# EAGLE design MOD-W_V03 (EAGLE 9.6.2)

## Sheet 1 of 2
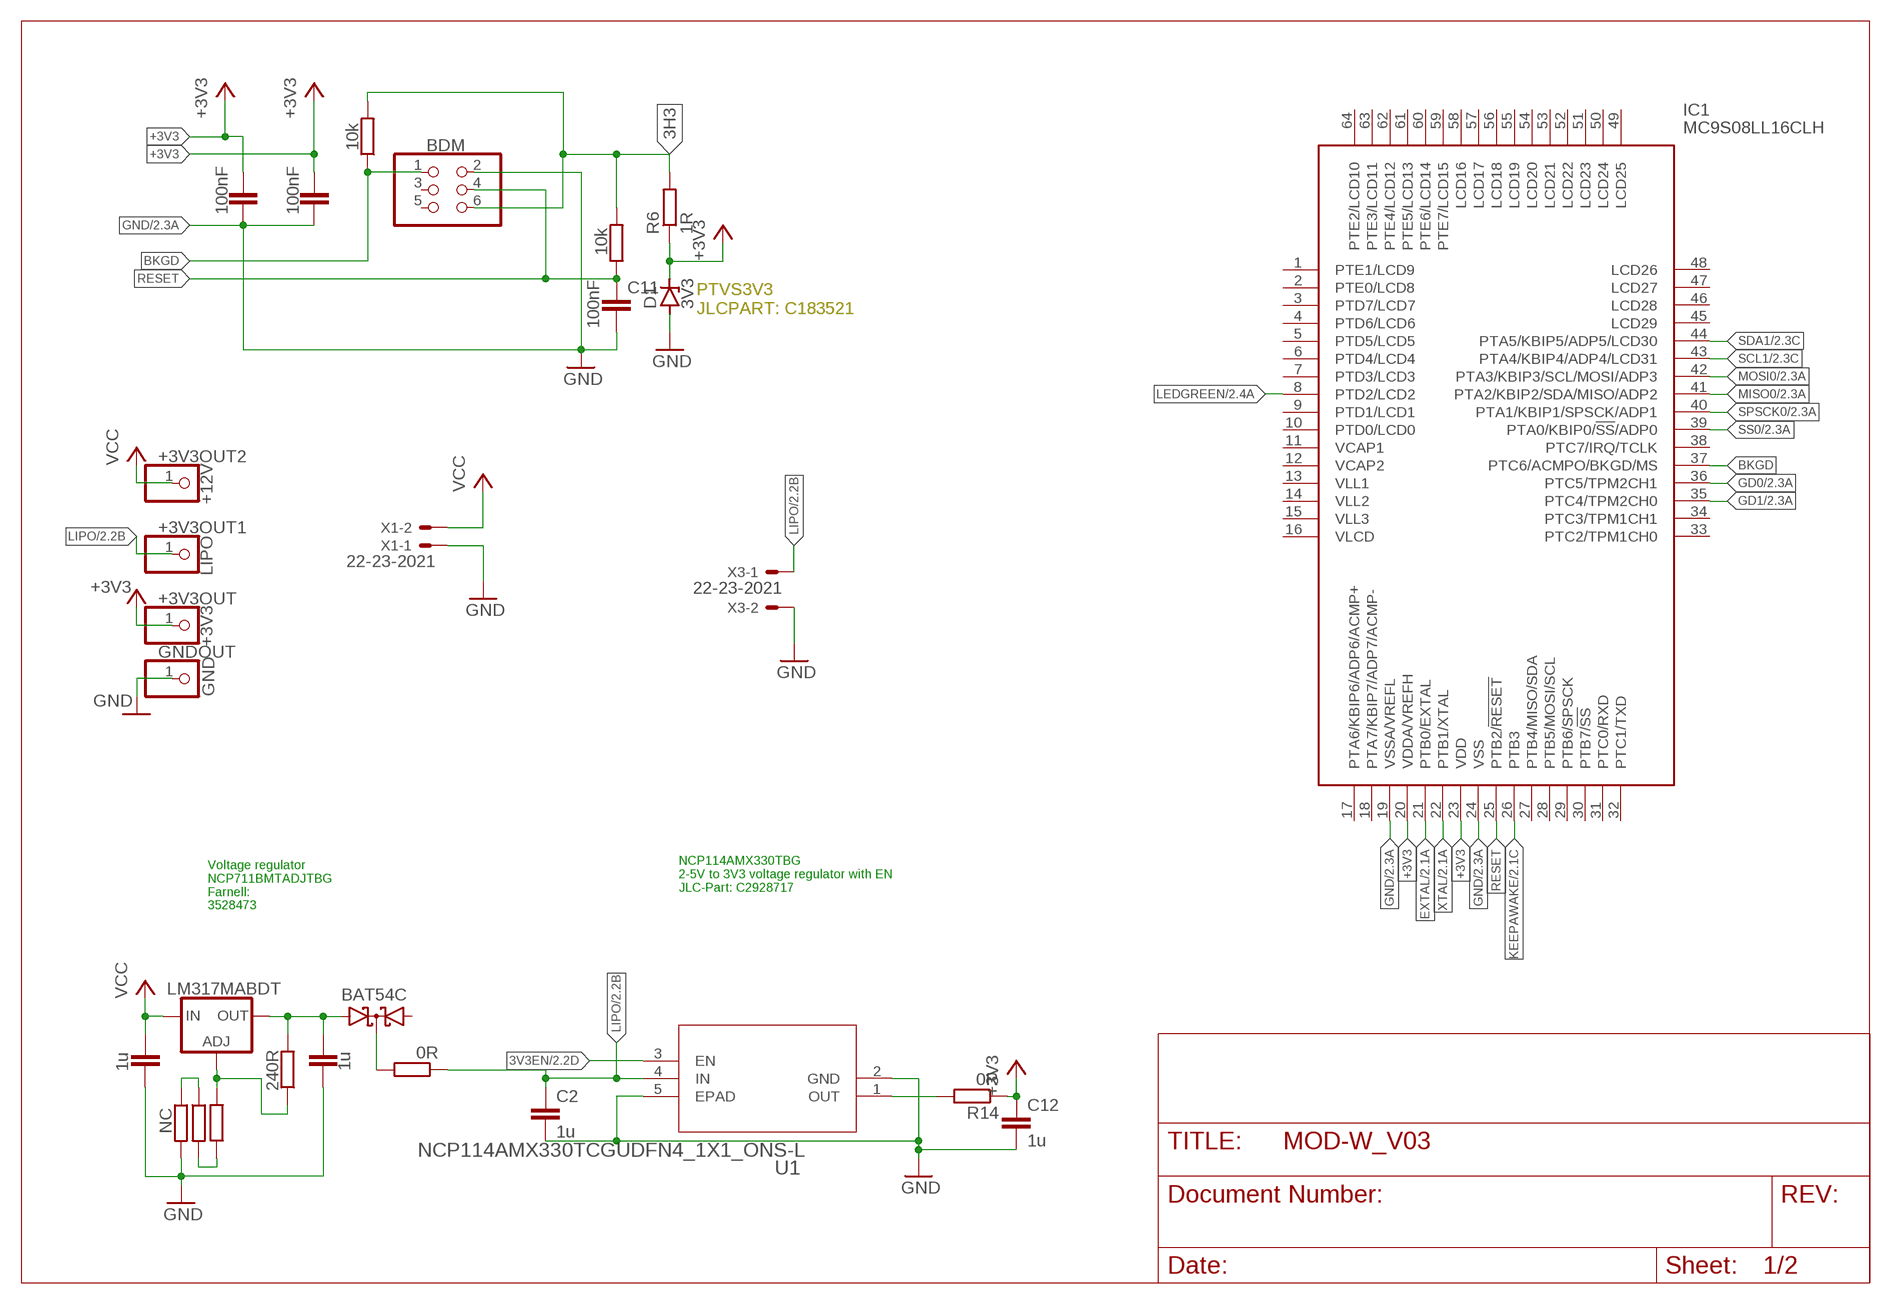
[diagram p0: schematic, sheet 1]

### Parts
+3V3OUT  +3V3  PINHD-1X1  [1X01]
+3V3OUT1  LIPO  PINHD-1X1  [1X01]
+3V3OUT2  +12V  PINHD-1X1  [1X01]
BDM  PINHD-2X3  [2X03]
C1  1u  C-EUC0805  [C0805]
C2  1u  C-EUC0805  [C0805]
C9  100nF  C-EUC0805  [C0805]
C10  100nF  C-EUC0805  [C0805]
C11  100nF  C-EUC0805  [C0805]
C12  1u  C-EUC0805  [C0805]
C13  1u  C-EUC0805  [C0805]
D1  3V3  ZENER-DIODESOD80C  [SOD80C]
D7  BAT54C  [SOT23]
GNDOUT  GND  PINHD-1X1  [1X01]
IC1  MC9S08LL16CLH  [QFP50P1200X1200X160-64N]
IC4  LM317MABDT  [DPACK]
R2  NC  R-EU_R0805  [R0805]
R6  1R  R-EU_R0805  [R0805]
R7  0R  R-EU_R0805  [R0805]
R14  0R  R-EU_R0805  [R0805]
R15  240R  R-EU_R0805  [R0805]
R16  10k  R-EU_R0805  [R0805]
R17  10k  R-EU_R0805  [R0805]
R18  NC  R-EU_R0805  [R0805]
R19  NC  R-EU_R0805  [R0805]
U1  NCP114AMX330TCGUDFN4_1X1_ONS-L  [UDFN4_1X1_ONS-L]
X1  22-23-2021  [22-23-2021]
X3  22-23-2021  [22-23-2021]

### Nets
3H3: BDM.6 R6.2 R16.2 R17.2
3V3EN: U1.3(EN) ; also sheet 2
+3V3: +3V3OUT.1 C9.1 C10.1 C12.1 D1.C IC1.20(VDDA/VREFH) IC1.23(VDD) R6.1 R14.1 ; also sheet 2
BKGD: BDM.1 IC1.37(PTC6/ACMPO/BKGD/MS) R16.1
EXTAL: IC1.21(PTB0/EXTAL) ; also sheet 2
GD0: IC1.36(PTC5/TPM2CH1) ; also sheet 2
GD1: IC1.35(PTC4/TPM2CH0) ; also sheet 2
GND: BDM.2 C1.2 C2.2 C9.2 C10.2 C11.2 C12.2 C13.2 D1.A GNDOUT.1 IC1.19(VSSA/VREFL) IC1.24(VSS) R19.2 U1.2(GND) U1.5(EPAD) X1.1 X3.2 ; also sheet 2
KEEPAWAKE: IC1.26(PTB3) ; also sheet 2
LEDGREEN: IC1.8(PTD2/LCD2) ; also sheet 2
LIPO: +3V3OUT1.1 C2.1 R7.1 U1.4(IN) X3.1 ; also sheet 2
MISO0: IC1.41(PTA2/KBIP2/SDA/MISO/ADP2) ; also sheet 2
MOSI0: IC1.42(PTA3/KBIP3/SCL/MOSI/ADP3) ; also sheet 2
N$5: D7.3(CC) R7.2
N$7: R14.2 U1.1(OUT)
N$8: R2.2 R18.1
N$9: R2.1 R19.1
N$12: C1.1 D7.2(A2) IC4.4(OUT) R15.2
N$14: IC4.1(ADJ) R15.1 R18.2
RESET: BDM.4 C11.1 IC1.25(PTB2/!RESET) R17.1
SCL1: IC1.43(PTA4/KBIP4/ADP4/LCD31) ; also sheet 2
SDA1: IC1.44(PTA5/KBIP5/ADP5/LCD30) ; also sheet 2
SPSCK0: IC1.40(PTA1/KBIP1/SPSCK/ADP1) ; also sheet 2
SS0: IC1.39(PTA0/KBIP0/!SS!/ADP0) ; also sheet 2
VCC: +3V3OUT2.1 C13.1 IC4.3(IN) X1.2
XTAL: IC1.22(PTB1/XTAL) ; also sheet 2
Unconnected: BDM.3 BDM.5 D7.1(A1) IC1.1(PTE1/LCD9) IC1.2(PTE0/LCD8) IC1.3(PTD7/LCD7) IC1.4(PTD6/LCD6) IC1.5(PTD5/LCD5) IC1.6(PTD4/LCD4) IC1.7(PTD3/LCD3) IC1.9(PTD1/LCD1) IC1.10(PTD0/LCD0) IC1.11(VCAP1) IC1.12(VCAP2) IC1.13(VLL1) IC1.14(VLL2) IC1.15(VLL3) IC1.16(VLCD) IC1.17(PTA6/KBIP6/ADP6/ACMP+) IC1.18(PTA7/KBIP7/ADP7/ACMP-) IC1.27(PTB4/MISO/SDA) IC1.28(PTB5/MOSI/SCL) IC1.29(PTB6/SPSCK) IC1.30(PTB7/!SS) IC1.31(PTC0/RXD) IC1.32(PTC1/TXD) IC1.33(PTC2/TPM1CH0) IC1.34(PTC3/TPM1CH1) IC1.38(PTC7/IRQ/TCLK) IC1.45(LCD29) IC1.46(LCD28) IC1.47(LCD27) IC1.48(LCD26) IC1.49(LCD25) IC1.50(LCD24) IC1.51(LCD23) IC1.52(LCD22) IC1.53(LCD21) IC1.54(LCD20) IC1.55(LCD19) IC1.56(LCD18) IC1.57(LCD17) IC1.58(LCD16) IC1.59(PTE7/LCD15) IC1.60(PTE6/LCD14) IC1.61(PTE5/LCD13) IC1.62(PTE4/LCD12) IC1.63(PTE3/LCD11) IC1.64(PTE2/LCD10)

### Notes on the sheet
- PTVS3V3 
  JLCPART: C183521
- NCP114AMX330TBG
  2-5V to 3V3 voltage regulator with EN
  JLC-Part: C2928717
- Voltage regulator
  NCP711BMTADJTBG
  Farnell: 
  3528473

## Sheet 2 of 2
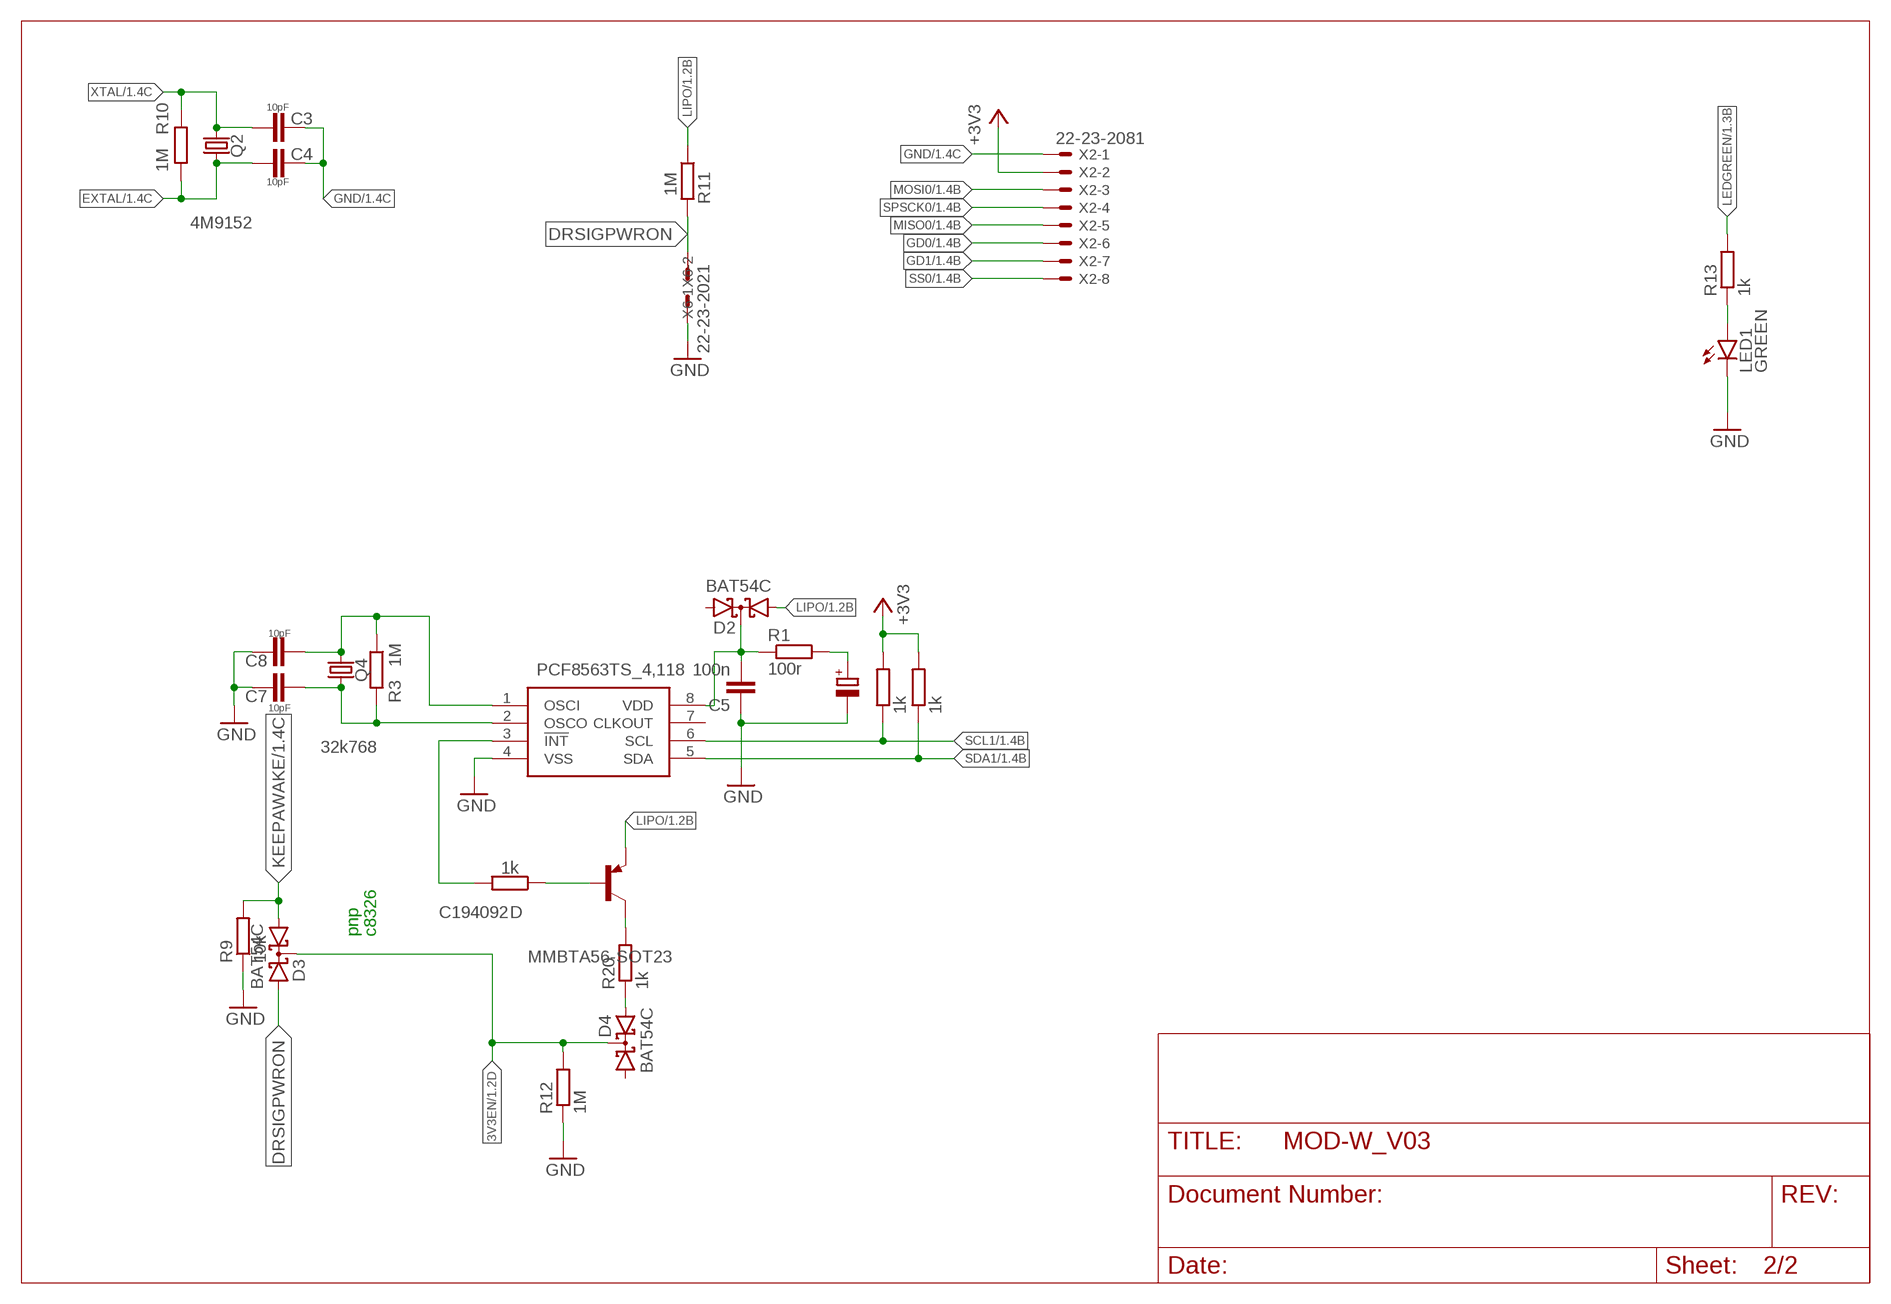
[diagram p1: schematic, sheet 2]

### Parts
C3  10pF  C-EUC0805  [C0805]
C4  10pF  C-EUC0805  [C0805]
C5  100n  C-EUC0805  [C0805]
C6  100u  CPOL-EUE  [PANASONIC_E]
C7  10pF  C-EUC0805  [C0805]
C8  10pF  C-EUC0805  [C0805]
D2  BAT54C  [SOT23]
D3  BAT54C  [SOT23]
D4  BAT54C  [SOT23]
IC3  PCF8563TS_4,118  [SOP65P490X110-8N]
LED1  GREEN  LEDCHIP-LED0805  [CHIP-LED0805]
Q2  4M9152  CRYSTALHC49UP  [HC49UP]
Q3  MMBTA56-SOT23  [SOT23]
Q4  32k768  CRYSTALTC38H  [TC38H]
R1  100r  R-EU_R0805  [R0805]
R3  1M  R-EU_R0805  [R0805]
R4  1k  R-EU_R0805  [R0805]
R5  1k  R-EU_R0805  [R0805]
R8  1k  R-EU_R0805  [R0805]
R9  10k  R-EU_R0805  [R0805]
R10  1M  R-EU_R0805  [R0805]
R11  1M  R-EU_R0805  [R0805]
R12  1M  R-EU_R0805  [R0805]
R13  1k  R-EU_R0805  [R0805]
R20  1k  R-EU_R0805  [R0805]
X2  22-23-2081  [22-23-2081]
X6  22-23-2021  [22-23-2021]

### Nets
3V3EN: D3.3(CC) D4.3(CC) R12.2 ; also sheet 1
+3V3: R4.2 R5.2 X2.2 ; also sheet 1
DRSIGPWRON: D3.2(A2) R11.2 X6.1
EXTAL: C4.1 Q2.1 R10.1 ; also sheet 1
EXTAL1: C8.1 IC3.1(OSCI) Q4.2 R3.1
GD0: X2.6 ; also sheet 1
GD1: X2.7 ; also sheet 1
GND: C3.2 C4.2 C5.1 C6.- C7.2 C8.2 IC3.4(VSS) LED1.C R9.1 R12.1 X2.1 X6.2 ; also sheet 1
KEEPAWAKE: D3.1(A1) R9.2 ; also sheet 1
LEDGREEN: R13.2 ; also sheet 1
LIPO: D2.1(A1) Q3.2(E) R11.1 ; also sheet 1
MISO0: X2.5 ; also sheet 1
MOSI0: X2.3 ; also sheet 1
N$1: C5.2 D2.3(CC) IC3.8(VDD) R1.1
N$2: C6.+ R1.2
N$3: IC3.3(!INT) R8.2
N$4: Q3.1(B) R8.1
N$6: D4.2(A2) R20.1
N$10: LED1.A R13.1
N$11: Q3.3(C) R20.2
SCL1: IC3.6(SCL) R4.1 ; also sheet 1
SDA1: IC3.5(SDA) R5.1 ; also sheet 1
SPSCK0: X2.4 ; also sheet 1
SS0: X2.8 ; also sheet 1
XTAL: C3.1 Q2.2 R10.2 ; also sheet 1
XTAL1: C7.1 IC3.2(OSCO) Q4.1 R3.2
Unconnected: D2.2(A2) D4.1(A1) IC3.7(CLKOUT)

### Notes on the sheet
- C194092 | D
- pnp | c8326

## Library data of the parts
+3V3OUT +3V3OUT1 +3V3OUT2 GNDOUT = pinhead:PINHD-1X1: PIN HEADER
BDM = pinhead:PINHD-2X3: PIN HEADER
C1-C5 C7-C13 = rcl:C-EU: CAPACITOR, European symbol; SPICEPREFIX: C
C6 = rcl:CPOL-EU: POLARIZED CAPACITOR, European symbol; SPICEPREFIX: C
D1 = diode:ZENER-DIODE: Z-Diode
D2-D4 D7 = diode:BAT54C: Schottky Diodes Source: Fairchild .. BAT54.pdf
IC1 = MC9S08LL16CLH:MC9S08LL16CLH: MCU 8-bit S08 CISC 16KB Flash 2.5V/3.3V 64-Pin LQFP Tray Source: Datasheet <http://www.nxp.com/docs/en/data-sheet/MC9S08LL16.pdf>; ARROW_PART_NUMBER: MC9S08LL16CLH; ARROW_PRICE-STOCK: https://www.arrow.com/en/products/mc9s08ll16clh/nxp-semiconductors; DESCRIPTION: MCU 8-bit S08 CISC 16KB Flash 2.5V/3.3V 64-Pin LQFP Tray; HEIGHT: 1.6mm; MANUFACTURER_NAME: NXP; MANUFACTURER_PART_NUMBER: MC9S08LL16CLH; MOUSER_PART_NUMBER: 841-MC9S08LL16CLH; MOUSER_PRICE-STOCK: https://www.mouser.com/Search/Refine.aspx?Keyword=841-MC9S08LL16CLH
IC3 = PCF8563TS_4_118:PCF8563TS_4,118: Real Time Clock ULTRA LOW PWR CLOCK RTC IC Source: Datasheet <http://www.nxp.com/docs/en/data-sheet/PCF8563.pdf>; ARROW_PART_NUMBER: PCF8563TS/4,118; ARROW_PRICE-STOCK: https://www.arrow.com/en/products/pcf8563ts4118/nxp-semiconductors?region=nac; DESCRIPTION: Real Time Clock ULTRA LOW PWR CLOCK RTC IC; HEIGHT: 1.1mm; MANUFACTURER_NAME: NXP; MANUFACTURER_PART_NUMBER: PCF8563TS/4,118; MOUSER_PART_NUMBER: 771-PCF8563TS-T; MOUSER_PRICE-STOCK: https://www.mouser.co.uk/ProductDetail/NXP-Semiconductors/PCF8563TS-4118?qs=LOCUfHb8d9ugg%2FdJSyv6Ig%3D%3D
IC4 = v-reg:LM317?*: 500 mA Adjustable Output Positive Voltage Regulator Source: http://www.onsemi.co.jp .. LM317M-D.PDF
LED1 = led:LED: LED OSRAM: - CHIPLED LG R971, LG N971, LY N971, LG Q971, LY Q971, LO R971, LY R971 LH N974, LH R974 LS Q976, LO Q976, LY Q976 LO Q996 - Hyper CHIPLED LW Q18S LB Q993, LB Q99A, LB R99A - SideLED LS A670, LO A670, LY A670, LG A670, LP A670 LB A673, LV A673, LT A673, LW A673 LH A674 LY A675 LS A676, LA A676, LO A676, LY A676, LW A676 LS A679, LY A679, LG A679 - Hyper Micro SIDELED® LS Y876, LA Y876, LO Y876, LY Y876 LT Y87S - SmartLED LW L88C, LW L88S LB L89C, LB L89S, LG L890 LS L89K, LO L89K, LY L89K LS L896, LA L896, LO L896, LY L896 - TOPLED LS T670, LO T670, LY T670, LG T670, LP T670 LSG T670, LSP T670, LSY T670, LOP T670, LYG T670 LG T671, LOG T671, LSG T671 LB T673, LV T673, LT T673, LW T673 LH T674 LS T676, LA T676, LO T676, LY T676, LB T676, LH T676, LSB T676, LW T676 LB T67C, LV T67C, LT T67C, LS T67K, LO T67K, LY T67K, LW E67C LS E67B, LA E67B, LO E67B, LY E67B, LB E67C, LV E67C, LT E67C LW T67C LS T679, LY T679, LG T679 LS T770, LO T770, LY T770, LG T770, LP T770 LB T773, LV T773, LT T773, LW T773 LH T774 LS E675, LA E675, LY E675, LS T675 LS T776, LA T776, LO T776, LY T776, LB T776 LHGB T686 LT T68C, LB T68C - Hyper Mini TOPLED® LB M676 - Mini TOPLED Santana® LG M470 LS M47K, LO M47K, LY M47K Source: http://www.osram.convergy.de LUXEON: - LUMILED® LXK2-PW12-R00, LXK2-PW12-S00, LXK2-PW14-U00, LXK2-PW14-V00 LXK2-PM12-R00, LXK2-PM12-S00, LXK2-PM14-U00 LXK2-PE12-Q00, LXK2-PE12-R00, LXK2-PE12-S00, LXK2-PE14-T00, LXK2-PE14-U00 LXK2-PB12-K00, LXK2-PB12-L00, LXK2-PB12-M00, LXK2-PB14-N00, LXK2-PB14-P00, LXK2-PB14-Q00 LXK2-PR12-L00, LXK2-PR12-M00, LXK2-PR14-Q00, LXK2-PR14-R00 LXK2-PD12-Q00, LXK2-PD12-R00, LXK2-PD12-S00 LXK2-PH12-R00, LXK2-PH12-S00 LXK2-PL12-P00, LXK2-PL12-Q00, LXK2-PL12-R00 Source: www.luxeon.com KINGBRIGHT: KA-3528ASYC Source: www.kingbright.com
Q2 Q4 = crystal:CRYSTAL: CRYSTAL; OC_FARNELL: unknown; OC_NEWARK: unknown
Q3 = transistor-pnp:*-?: PNP Transistor
R1-R20 = rcl:R-EU_: RESISTOR, European symbol; SPICEPREFIX: R
U1 = 2022-03-26_17-13-47_Library:NCP114AMX330TCG; COPYRIGHT: Copyright (C) 2022 Ultra Librarian. All rights reserved.; MANUFACTURER_PART_NUMBER: NCP114AMX330TCG; MFR_NAME: onsemi
X1 X3 X6 = con-molex:22-23-2021: .100" (2.54mm) Center Header - 2 Pin; MF: MOLEX; MPN: 22-23-2021; OC_FARNELL: 1462926; OC_NEWARK: 25C3832
X2 = con-molex:22-23-2081: .100" (2.54mm) Center Header - 8 Pin; MF: MOLEX; MPN: 22-23-2081; OC_FARNELL: 1756826; OC_NEWARK: 01C7592

## Board
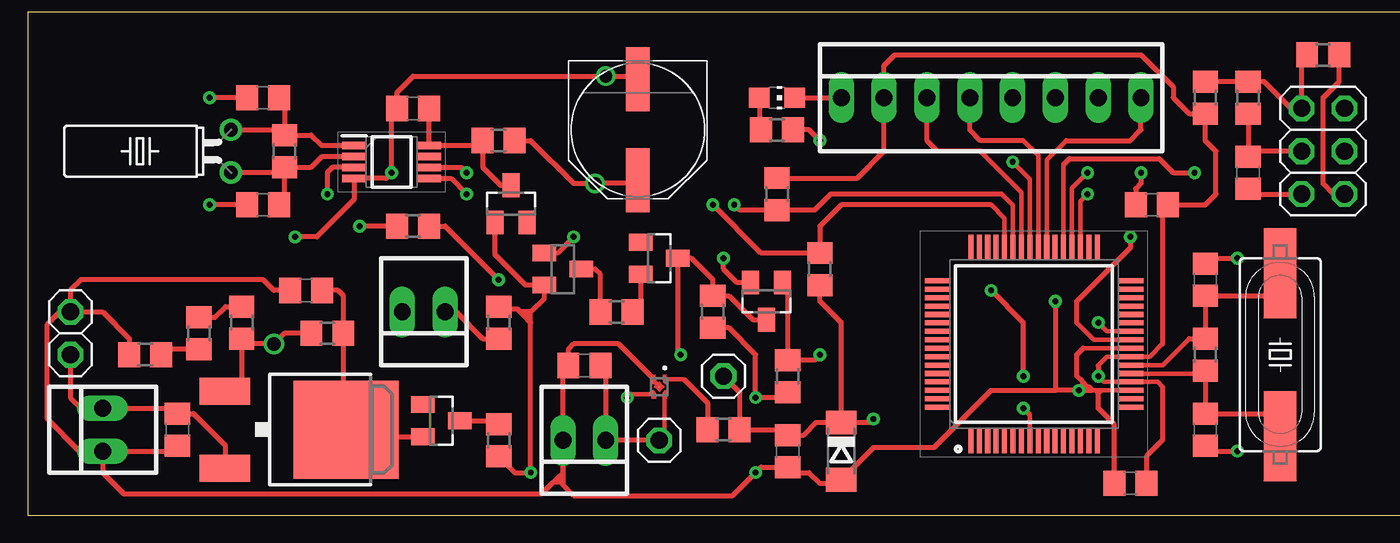
[diagram p2: board, top side]
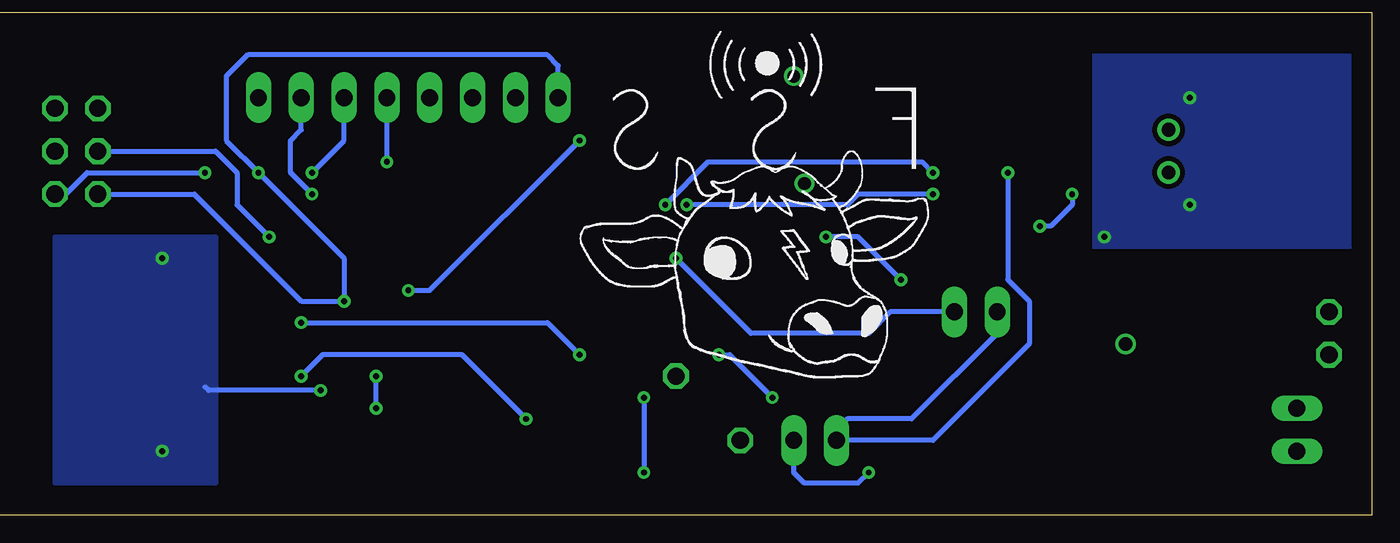
[diagram p3: board, bottom side, seen from below]

No outline drawn. Coordinates in mm, seen from the top.
Copper layers (1*16): Top 0.035mm / dielectric 1.5mm / Bottom 0.035mm
Design rules "default *": minimum track width 6mil, minimum drill 0.35mm, track to track 12mil, track to pad 12mil, pad to pad 12mil, via to via 12mil, smd to smd 12mil, copper to edge 40mil, drill to drill 12mil, minimum pad ring 10mil, minimum via ring 8mil, stop-mask expansion 4mil, vias tented up to drill 0mil, thermal gap 10mil
Milling: 4 lines

### Footprints (pad centres in the part's own frame; a part is rotated, then mirrored left to right if it is on the bottom)
1X01 = drill 1.016 octagon: 1 0,0
2X03 = drill 1.016 octagon: 1 -2.54,-1.27; 2 -2.54,1.27; 3 0,-1.27; 4 0,1.27; 5 2.54,-1.27; 6 2.54,1.27
C0805 = smd 1.3 x 1.5: 1 -0.95,0; 2 0.95,0
PANASONIC_E = smd 3.8 x 1.4: + 3,0; - -3,0
SOD80C = smd 1.4 x 1.8: A 1.7,0; C -1.7,0
SOT23 = smd 1 x 1.4: 1 -0.95,-1.1; 2 0.95,-1.1; 3 0,1.1
QFP50P1200X1200X160-64N = smd 1.475 x 0.3: 1 -5.738,3.75; 2 -5.738,3.25; 3 -5.738,2.75; 4 -5.738,2.25; 5 -5.738,1.75; 6 -5.738,1.25; 7 -5.738,0.75; 8 -5.738,0.25; 9 -5.738,-0.25; 10 -5.738,-0.75; 11 -5.738,-1.25; 12 -5.738,-1.75; 13 -5.738,-2.25; 14 -5.738,-2.75; 15 -5.738,-3.25; 16 -5.738,-3.75; 33 5.738,-3.75; 34 5.738,-3.25; 35 5.738,-2.75; 36 5.738,-2.25; 37 5.738,-1.75; 38 5.738,-1.25; 39 5.738,-0.75; 40 5.738,-0.25; 41 5.738,0.25; 42 5.738,0.75; 43 5.738,1.25; 44 5.738,1.75; 45 5.738,2.25; 46 5.738,2.75; 47 5.738,3.25; 48 5.738,3.75 | smd 0.3 x 1.475: 17 -3.75,-5.738; 18 -3.25,-5.738; 19 -2.75,-5.738; 20 -2.25,-5.738; 21 -1.75,-5.738; 22 -1.25,-5.738; 23 -0.75,-5.738; 24 -0.25,-5.738; 25 0.25,-5.738; 26 0.75,-5.738; 27 1.25,-5.738; 28 1.75,-5.738; 29 2.25,-5.738; 30 2.75,-5.738; 31 3.25,-5.738; 32 3.75,-5.738; 49 3.75,5.738; 50 3.25,5.738; 51 2.75,5.738; 52 2.25,5.738; 53 1.75,5.738; 54 1.25,5.738; 55 0.75,5.738; 56 0.25,5.738; 57 -0.25,5.738; 58 -0.75,5.738; 59 -1.25,5.738; 60 -1.75,5.738; 61 -2.25,5.738; 62 -2.75,5.738; 63 -3.25,5.738; 64 -3.75,5.738
SOP65P490X110-8N = smd 1.425 x 0.45: 1 -2.212,0.975; 2 -2.212,0.325; 3 -2.212,-0.325; 4 -2.212,-0.975; 5 2.212,-0.975; 6 2.212,-0.325; 7 2.212,0.325; 8 2.212,0.975
DPACK = smd 1.6 x 3: 1 -2.28,-4.8; 3 2.28,-4.8 | smd 5.8 x 6.2: 4 0,2.38
CHIP-LED0805 = smd 1.2 x 1.2: A 0,-1.05; C 0,1.05
HC49UP = smd 5.334 x 1.93: 1 -4.826,0; 2 4.826,0
TC38H = drill 0.813: 1 -1.27,0; 2 1.27,0
R0805 = smd 1.3 x 1.5: 1 -0.95,0; 2 0.95,0
UDFN4_1X1_ONS-L = smd 0.025 x 0.025: 1 -0.445,0.325; 2 -0.445,-0.325; 3 0.445,-0.325; 4 0.445,0.325; 5 0,0
22-23-2021 = drill 1 long: 1 -1.27,0; 2 1.27,0
22-23-2081 = drill 1 long: 1 -8.89,0; 2 -6.35,0; 3 -3.81,0; 4 -1.27,0; 5 1.27,0; 6 3.81,0; 7 6.35,0; 8 8.89,0

### Placement (x,y rotation side)
+3V3OUT  41.27,6.99 0 top
+3V3OUT1  37.47,3.17 0 top
+3V3OUT2  2.54,8.26 0 top
BDM  76.83,20.32 90 top
C1  16.51,12.06 180 top
C2  33.02,7.62 180 top
C3  69.85,12.7 90 top
C4  69.85,3.81 270 top
C5  22.86,22.86 0 top
C6  36.2,21.59 270 top
C7  13.97,17.14 180 top
C8  13.97,23.5 180 top
C9  66.67,17.14 180 top
C10  65.41,0.64 180 top
C11  72.39,19.05 270 top
C12  45.09,2.54 270 top
C13  8.89,3.81 270 top
D1  48.26,2.54 270 top
D2  28.67,17.2 0 top
D3  43.81,11.43 180 top
D4  37.47,13.97 270 top
D7  24.55,4.35 270 top
GNDOUT  2.54,10.79 0 top
IC1  59.69,8.89 90 top
IC3  21.59,19.68 0 top
IC4  16.51,3.81 270 top
LED1  44.45,23.5 270 top
Q2  74.3,8.26 90 top
Q3  31.75,13.34 270 top
Q4  12.06,20.32 90 top
R1  27.94,20.95 0 top
R2  10.16,9.53 90 top
R3  15.24,20.32 270 top
R4  44.45,17.78 90 top
R5  46.99,13.34 270 top
R6  69.85,23.5 90 top
R7  27.94,3.17 90 top
R8  22.86,15.88 180 top
R9  45.09,6.99 90 top
R10  69.85,8.26 90 top
R11  27.94,10.16 270 top
R12  40.64,10.79 90 top
R13  44.45,21.59 0 top
R14  41.27,3.81 180 top
R15  17.78,9.53 0 top
R16  76.83,26.04 180 top
R17  72.39,23.5 90 top
R18  12.7,10.16 270 top
R19  6.99,8.26 180 top
R20  34.92,10.79 180 top
U1  37.47,6.35 270 top
X1  4.45,3.81 90 top
X2  57.15,23.5 0 top
X3  33.02,3.17 180 top
X6  23.5,10.79 180 top

### Tracks (layer width: path | path; a pad name or v marks a point on that pad's centre or on a via)
3H3
  Top 0.305: R16.2 75.56,25.71 BDM.6 74.93,22.86 73.34,24.45 R17.2 R6.2
3V3EN  (via drill 0.35)
  Top 0.254: U1.3 35.75,5.91
  Top 0.305: 35.75,5.91 v35.56,5.71 | v38.73,8.26 38.56,8.43 D4.3 39.37,13.97 40.64,12.7 R12.2 41.59,11.74 43.01,10.33 D3.3
  Bottom 0.305: v38.73,8.26 38.1,8.26 v35.56,5.71
+3V3  (via drill 0.35)
  Top 0.254: 63.5,7.62 64.02,8.14 IC1.23 66.56,8.14 67.31,8.89 | v63.5,6.99 63.84,6.64 IC1.20 67.02,6.64 67.31,6.35
  Top 0.305: 63.5,7.62 v63.5,6.99 | D1.C 46.78,4.24 46.03,3.49 C12.1 44.77,3.81 R14.1 42.23,6.04 +3V3OUT.1 | D1.C 48.26,10.16 46.99,11.43 R5.2 | D1.C 49.96,4.24 v50.16,4.45 | R4.2 49.21,18.73 50.8,20.32 X2.2 50.8,25.4 51.44,26.04 66.04,26.04 67.94,24.13 67.94,23.5 68.89,22.55 R6.1 69.85,20.95 70.48,20.32 70.48,17.78 69.85,17.14 C9.1 67.31,16.83 67.31,8.89 | 67.31,6.35 67.31,3.17 66.36,2.22 C10.1
  Bottom 0.305: v63.5,6.99 62.23,8.26 53.98,8.26 v50.16,4.45
BKGD  (via drill 0.35)
  Top 0.254: IC1.37 61.44,19.53
  Top 0.305: BDM.1 77.47,17.78 76.83,18.41 76.83,23.5 77.78,24.45 R16.1 | 61.44,19.53 61.8,19.89 67.11,19.89 67.94,19.05 v69.22,19.05
  Bottom 0.305: BDM.1 77.47,17.78 76.2,19.05 v69.22,19.05
DRSIGPWRON  (via drill 0.35)
  Top 0.305: X6.1 25.4,10.79 26.98,9.21 R11.2 | D3.2 42.08,12.53 41.27,13.34 v41.27,13.97
  Bottom 0.305: X6.1 28.57,10.79 29.84,9.53 36.83,9.53 v41.27,13.97
EXTAL
  Top 0.254: IC1.21 69.69,7.14
  Top 0.305: Q2.1 74.3,5.08 73.97,4.76 C4.1 R10.1 69.69,7.14
EXTAL1
  Top 0.305: C8.1 15.24,23.18 R3.1 | Q4.2 14.92,21.59 R3.1 | R3.1 16.83,21.27 17.44,20.66 IC3.1
GD0  (via drill 0.35)
  Top 0.254: IC1.36 61.94,18.12 v62.87,19.05
  Bottom 0.305: v62.87,19.05 60.96,20.95 X2.6
GD1  (via drill 0.35)
  Top 0.254: IC1.35 62.44,17.36 v62.87,17.78
  Bottom 0.305: X2.7 63.5,21.59 64.14,20.95 64.14,19.05 v62.87,17.78
GND  (via drill 0.35, 0.75)
  Top 0.254: IC1.19 64.14,6.14 | 64.14,6.14 63.5,6.14 | 63.5,6.14 63.08,6.14 | IC1.24 62.62,8.64 | U1.5 37.14,6.67 U1.2 | 63.5,5.97 63.5,6.14 | 64.14,6.14 63.67,6.14 63.5,5.97 | 63.15,6.15 63.32,6.15 63.5,5.97
  Top 0.305: C7.2 v10.79,17.14 | C8.2 v10.79,23.5 | v15.88,15.24 17.14,15.24 19.38,17.47 IC3.4 21.25,18.71 v21.59,19.05 21.59,22.54 C5.1 21.91,23.82 22.86,24.77 v34.29,24.77 36.2,24.77 C6.- | X1.1 4.45,1.27 5.71,0 30.48,0 31.18,0.7 | X1.1 3.07,2.54 1.17,4.45 1.17,10.06 1.91,10.79 GNDOUT.1 | 31.18,0.7 31.3,0.83 | 31.3,0.83 31.43,0.95 | 31.43,0.95 31.75,1.27 X3.2 | X3.2 31.75,7.3 C2.2 32.07,8.57 32.38,8.89 35.04,8.89 U1.2 | GNDOUT.1 4.45,10.79 6.04,9.21 R19.2 | GNDOUT.1 2.54,12.06 3.17,12.7 13.97,12.7 14.61,12.06 C1.2 | X3.2 31.75,0.64 | 31.75,0.53 32.38,-0.1 41.81,-0.1 v43.18,1.27 43.5,1.59 C12.2 45.41,1.27 46.35,1.27 46.99,0.64 48.05,0.64 D1.A 50.16,2.75 53.76,2.75 57.15,6.14 60.96,6.14 | C11.2 72.71,17.78 BDM.2 | 62.87,6.35 63.08,6.14 62.74,6.14 | 62.87,6.35 62.55,6.67 | 62.55,6.67 62.23,6.99 62.23,8.26 62.62,8.64 | 62.55,6.67 62.55,6.33 | 62.74,6.14 62.55,6.33 | 62.55,6.33 v62.36,6.14 | C4.2 70.17,2.54 v71.75,2.54 | C3.2 70.17,13.97 v71.75,13.97 | v62.36,6.14 60.96,6.14 | R9.1 44.77,5.71 v43.18,5.71 43.18,8.26 41.59,9.85 R12.1 | 31.75,0.64 31.75,0.53 | 31.75,0.64 31.43,0.95 | 31.59,0.7 31.46,0.83 31.3,0.83 | 31.75,0.53 31.59,0.7 | 31.59,0.7 31.18,0.7 | LED1.C X2.1 | X1.1 8.57,2.54 C13.2 | C10.2 64.45,4.12 63.5,5.08 63.5,5.97 | 62.87,6.35 62.95,6.35 63.15,6.15 | 62.74,6.14 v62.36,6.14 | v60.96,11.43 60.96,6.14 | C9.2 65.72,18.1 66.04,18.41 v66.04,19.05
  Bottom 0.305: BDM.2 69.85,17.78 63.5,11.43 v60.96,11.43 60.96,13.97 v66.04,19.05 67.94,20.95 67.94,24.77 66.67,26.04 48.9,26.04 48.26,25.4 X2.1 | X6.2 22.23,9.53 27.3,4.45 31.11,4.45 31.75,3.81 X3.2 26.04,3.17 20.32,8.89 20.32,11.43 21.59,12.7 v21.59,19.05 | v43.18,5.71 v43.18,1.27 | v62.36,6.14 69,6.14 69.22,6.35
  pour Bottom: 16.51,14.61 16.51,26.04 1.27,26.04 1.27,14.61
  pour Bottom: 68.58,15.24 68.58,0.64 78.11,0.64 78.11,15.24
KEEPAWAKE  (via drill 0.35)
  Top 0.254: IC1.26 64.02,9.64 v63.5,10.16
  Top 0.305: v46.99,8.26 46.67,7.93 R9.2 45.09,12.21 D3.1
  Bottom 0.305: v63.5,10.16 48.9,10.16 v46.99,8.26
LEDGREEN  (via drill 0.35)
  Top 0.254: IC1.8 59.44,4.7
  Top 0.305: 59.44,4.7 v59.05,5.08 | v59.05,6.99 59.05,10.16 v57.15,12.06 | v46.99,20.95 46.35,21.59 R13.2
  Bottom 0.305: v59.05,5.08 v59.05,6.99 | v57.15,12.06 55.88,12.06 v46.99,20.95
LIPO  (via drill 0.35)
  Top 0.254: U1.4 37.79,3.5
  Top 0.305: C2.1 34.29,7.3 X3.1 +3V3OUT1.1 37.79,3.5 | R7.1 28.89,1.27 v29.84,1.27 29.84,10.16 | R11.1 28.1,10.95 | 28.1,10.95 28.25,10.79 | 28.1,10.95 29.05,10.95 29.21,10.79 | 29.84,10.16 29.46,10.54 | 29.46,10.54 29.21,10.79 | 29.84,10.16 29.84,10.79 | 29.84,10.79 30.65,11.6 Q3.2 29.52,12.38 27.72,14.19 D2.1 | 29.72,10.79 29.21,10.79 | 29.84,10.79 29.72,10.79 | 29.72,10.79 29.46,10.54
  Bottom 0.305: v29.84,1.27 30.48,0.64 33.66,0.64 34.29,1.27 X3.1
MISO0  (via drill 0.35)
  Top 0.254: IC1.41 59.44,18.66 v58.42,19.68
  Bottom 0.305: v58.42,19.68 X2.5
MOSI0
  Top 0.254: IC1.42 58.94,17.89 56.52,20.32
  Top 0.305: 56.52,20.32 53.98,20.32 53.34,20.95 X2.3
N$1
  Top 0.305: C5.2 IC3.8 26.7,20.66 R1.1 26.99,19.36 28.05,18.3 D2.3
N$2  (via drill 0.75)
  Top 0.305: R1.2 29.84,20.95 32.38,18.41 v33.66,18.41 36.02,18.41 C6.+
N$3  (via drill 0.35)
  Top 0.305: IC3.3 18.09,19.36 17.78,19.05 v17.78,17.78 | R8.2 v19.68,15.88
  Bottom 0.305: v17.78,17.78 17.78,17.14 19.05,15.88 v19.68,15.88
N$4  (via drill 0.35)
  Top 0.305: R8.1 24.77,15.88 v27.94,12.7 | Q3.1 31.43,14.29 v32.38,15.24
  Bottom 0.305: v27.94,12.7 30.48,15.24 v32.38,15.24
N$5
  Top 0.305: D7.3 27.3,4.35 27.53,4.12 R7.2
N$6
  Top 0.305: D4.2 36.37,11.29 R20.1
N$7
  Top 0.254: U1.1 38.92,6.79
  Top 0.305: R14.2 40.33,5.39 38.92,6.79
N$8
  Top 0.305: R2.2 11.11,10.47 11.74,11.11 R18.1
N$9
  Top 0.305: R2.1 8.26,8.57 R19.1
N$10
  Top 0.305: LED1.A 43.4,21.69 R13.1
N$11
  Top 0.305: R20.2 33.98,13.02 33.66,13.34 Q3.3
N$12
  Top 0.305: C1.1 18.41,12.06 18.73,11.75 R15.2 18.73,3.97 IC4.4 19.3,3.4 D7.2
N$14  (via drill 0.8)
  Top 0.305: R15.1 15.24,9.53 v14.61,8.89 13.02,8.89 R18.2 12.7,6.35 12.44,6.09 IC4.1
RESET  (via drill 0.35)
  Top 0.254: IC1.25 63.25,9.14 62.23,10.16
  Top 0.305: R17.1 72.39,20.32 | 72.39,20.32 C11.1 | BDM.4 72.39,20.32 | 62.23,10.16 62.23,11.43 65.41,14.61 v65.41,15.24
  Bottom 0.305: BDM.4 68.58,20.32 67.31,19.05 67.31,17.14 v65.41,15.24
SCL1  (via drill 0.35)
  Top 0.254: IC1.43 58.44,17.12 57.78,17.78
  Top 0.305: IC3.6 25.73,19.36 v26.04,19.05 | v41.91,17.14 42.23,16.83 R4.1 46.67,16.83 47.62,17.78 57.78,17.78
  Bottom 0.305: v26.04,19.05 26.67,19.68 39.37,19.68 v41.91,17.14
SDA1  (via drill 0.35)
  Top 0.254: IC1.44 57.94,16.36 57.15,17.14
  Top 0.305: IC3.5 25.11,18.71 v26.04,17.78 | v40.64,17.14 43.5,14.29 R5.1 46.99,15.88 48.26,17.14 57.15,17.14
  Bottom 0.305: v26.04,17.78 30.48,17.78 31.11,17.14 v40.64,17.14
SPSCK0
  Top 0.254: 59.05,20.95 59.94,20.07 IC1.40
  Top 0.305: X2.4 55.88,21.59 56.52,20.95 59.05,20.95
SS0
  Top 0.254: IC1.39 60.44,19.8 61.59,20.95
  Top 0.305: 61.59,20.95 65.41,20.95 66.04,21.59 X2.8
VCC
  Top 0.305: +3V3OUT2.1 2.54,5.71 3.17,5.08 X1.2 8.57,5.08 C13.1 9.85,4.76 11.71,2.9 IC4.3
XTAL
  Top 0.254: IC1.22 67.33,7.64 68.89,9.21
  Top 0.305: Q2.2 74.3,11.43 73.97,11.75 C3.1 R10.2 68.89,9.21
XTAL1
  Top 0.305: C7.1 15.24,17.46 R3.2 | R3.2 16.83,19.37 17.47,20.01 IC3.2 | R3.2 14.92,19.05 Q4.1